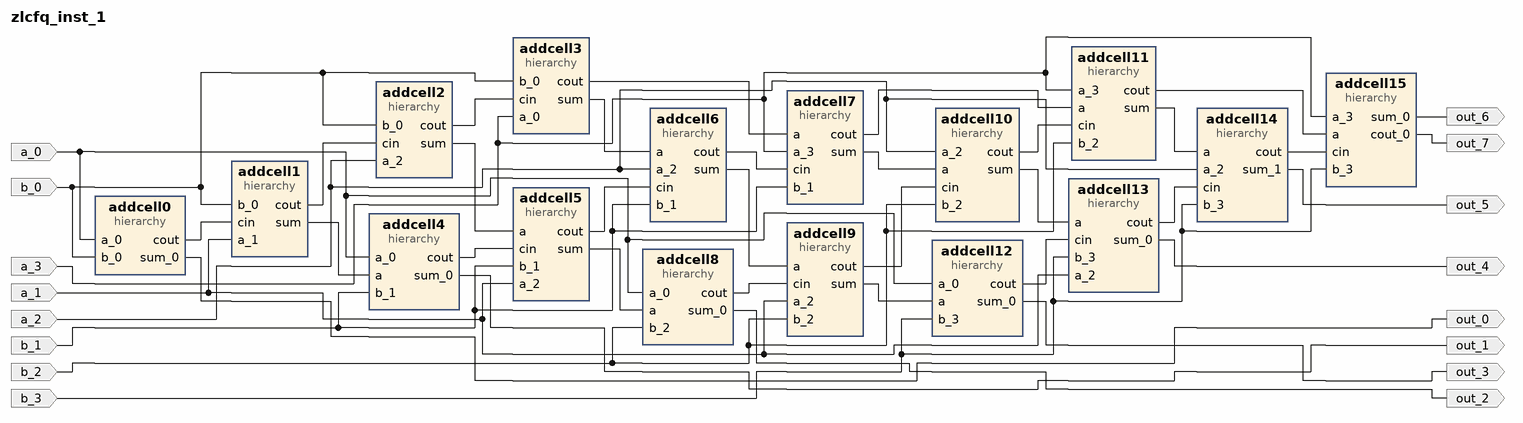
[diagram p0: block diagram of the top level]
# Vivado block design zlcfq_inst_1, xc7z020clg400-1, Vivado 2024.2
create_bd_design zlcfq_inst_1

create_bd_port -dir I a_0
create_bd_port -dir I a_1
create_bd_port -dir I a_2
create_bd_port -dir I a_3
create_bd_port -dir I b_0
create_bd_port -dir I b_1
create_bd_port -dir I b_2
create_bd_port -dir I b_3
create_bd_port -dir O out_0
create_bd_port -dir O out_1
create_bd_port -dir O out_2
create_bd_port -dir O out_3
create_bd_port -dir O out_4
create_bd_port -dir O out_5
create_bd_port -dir O out_6
create_bd_port -dir O out_7

create_bd_cell -type hier addcell0
create_bd_cell -type hier addcell1
create_bd_cell -type hier addcell10
create_bd_cell -type hier addcell11
create_bd_cell -type hier addcell12
create_bd_cell -type hier addcell13
create_bd_cell -type hier addcell14
create_bd_cell -type hier addcell15
create_bd_cell -type hier addcell2
create_bd_cell -type hier addcell3
create_bd_cell -type hier addcell4
create_bd_cell -type hier addcell5
create_bd_cell -type hier addcell6
create_bd_cell -type hier addcell7
create_bd_cell -type hier addcell8
create_bd_cell -type hier addcell9

# ---- hierarchy /addcell0 ----
current_bd_instance /addcell0
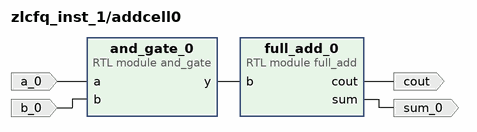
[diagram p1: block diagram inside /addcell0]
create_bd_pin -dir O cout
create_bd_pin -dir O sum_0
create_bd_pin -dir I a_0
create_bd_pin -dir I b_0

create_bd_cell -type module -reference full_add full_add_0
create_bd_cell -type module -reference and_gate and_gate_0

# ---- hierarchy /addcell1 ----
current_bd_instance /addcell1
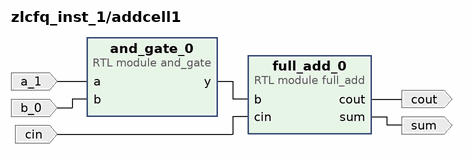
[diagram p2: block diagram inside /addcell1]
create_bd_pin -dir I cin
create_bd_pin -dir O cout
create_bd_pin -dir O sum
create_bd_pin -dir I a_1
create_bd_pin -dir I b_0

create_bd_cell -type module -reference full_add full_add_0
create_bd_cell -type module -reference and_gate and_gate_0

# ---- hierarchy /addcell10 ----
current_bd_instance /addcell10
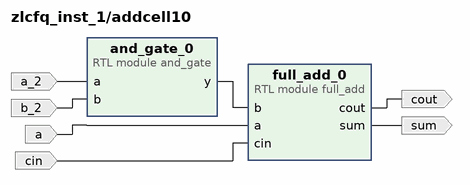
[diagram p3: block diagram inside /addcell10]
create_bd_pin -dir O cout
create_bd_pin -dir I cin
create_bd_pin -dir I a
create_bd_pin -dir O sum
create_bd_pin -dir I a_2
create_bd_pin -dir I b_2

create_bd_cell -type module -reference full_add full_add_0
create_bd_cell -type module -reference and_gate and_gate_0

# ---- hierarchy /addcell11 ----
current_bd_instance /addcell11
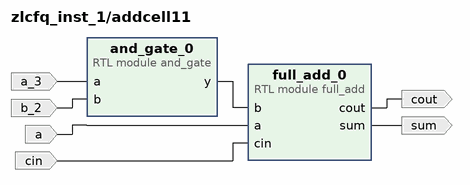
[diagram p4: block diagram inside /addcell11]
create_bd_pin -dir I cin
create_bd_pin -dir I a
create_bd_pin -dir O sum
create_bd_pin -dir O cout
create_bd_pin -dir I a_3
create_bd_pin -dir I b_2

create_bd_cell -type module -reference full_add full_add_0
create_bd_cell -type module -reference and_gate and_gate_0

# ---- hierarchy /addcell12 ----
current_bd_instance /addcell12
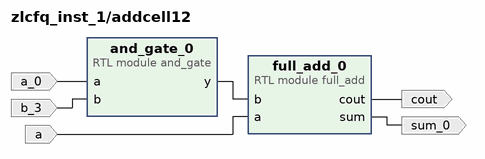
[diagram p5: block diagram inside /addcell12]
create_bd_pin -dir I a
create_bd_pin -dir O cout
create_bd_pin -dir O sum_0
create_bd_pin -dir I a_0
create_bd_pin -dir I b_3

create_bd_cell -type module -reference full_add full_add_0
create_bd_cell -type module -reference and_gate and_gate_0

# ---- hierarchy /addcell13 ----
current_bd_instance /addcell13
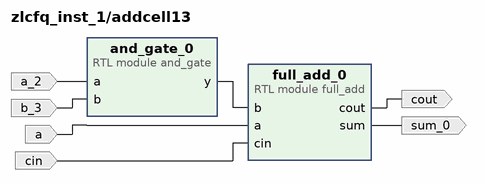
[diagram p6: block diagram inside /addcell13]
create_bd_pin -dir I cin
create_bd_pin -dir O cout
create_bd_pin -dir I a
create_bd_pin -dir O sum_0
create_bd_pin -dir I a_2
create_bd_pin -dir I b_3

create_bd_cell -type module -reference full_add full_add_0
create_bd_cell -type module -reference and_gate and_gate_0

# ---- hierarchy /addcell14 ----
current_bd_instance /addcell14
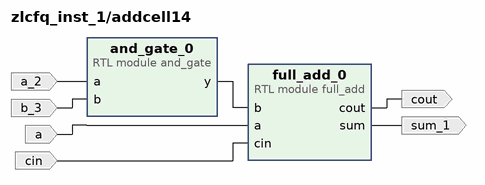
[diagram p7: block diagram inside /addcell14]
create_bd_pin -dir I cin
create_bd_pin -dir O cout
create_bd_pin -dir I a
create_bd_pin -dir O sum_1
create_bd_pin -dir I a_2
create_bd_pin -dir I b_3

create_bd_cell -type module -reference full_add full_add_0
create_bd_cell -type module -reference and_gate and_gate_0

# ---- hierarchy /addcell15 ----
current_bd_instance /addcell15
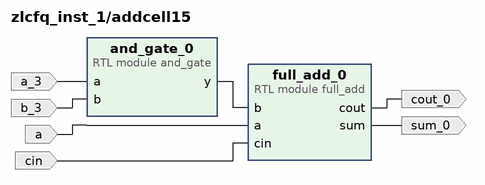
[diagram p8: block diagram inside /addcell15]
create_bd_pin -dir I cin
create_bd_pin -dir I a
create_bd_pin -dir O sum_0
create_bd_pin -dir O cout_0
create_bd_pin -dir I a_3
create_bd_pin -dir I b_3

create_bd_cell -type module -reference full_add full_add_0
create_bd_cell -type module -reference and_gate and_gate_0

# ---- hierarchy /addcell2 ----
current_bd_instance /addcell2
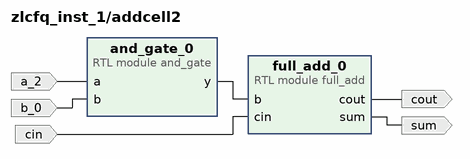
[diagram p9: block diagram inside /addcell2]
create_bd_pin -dir I cin
create_bd_pin -dir O cout
create_bd_pin -dir O sum
create_bd_pin -dir I a_2
create_bd_pin -dir I b_0

create_bd_cell -type module -reference full_add full_add_0
create_bd_cell -type module -reference and_gate and_gate_0

# ---- hierarchy /addcell3 ----
current_bd_instance /addcell3
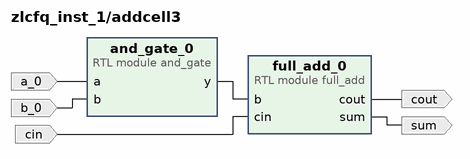
[diagram p10: block diagram inside /addcell3]
create_bd_pin -dir I cin
create_bd_pin -dir O sum
create_bd_pin -dir O cout
create_bd_pin -dir I a_0
create_bd_pin -dir I b_0

create_bd_cell -type module -reference full_add full_add_0
create_bd_cell -type module -reference and_gate and_gate_0

# ---- hierarchy /addcell4 ----
current_bd_instance /addcell4
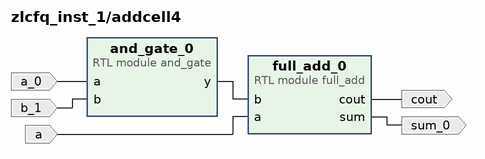
[diagram p11: block diagram inside /addcell4]
create_bd_pin -dir I a
create_bd_pin -dir O cout
create_bd_pin -dir O sum_0
create_bd_pin -dir I a_0
create_bd_pin -dir I b_1

create_bd_cell -type module -reference full_add full_add_0
create_bd_cell -type module -reference and_gate and_gate_0

# ---- hierarchy /addcell5 ----
current_bd_instance /addcell5
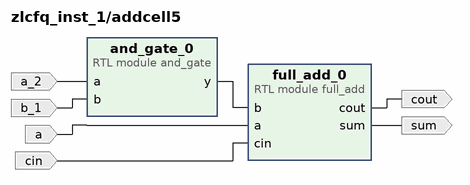
[diagram p12: block diagram inside /addcell5]
create_bd_pin -dir I cin
create_bd_pin -dir O cout
create_bd_pin -dir I a
create_bd_pin -dir O sum
create_bd_pin -dir I a_2
create_bd_pin -dir I b_1

create_bd_cell -type module -reference full_add full_add_0
create_bd_cell -type module -reference and_gate and_gate_0

# ---- hierarchy /addcell6 ----
current_bd_instance /addcell6
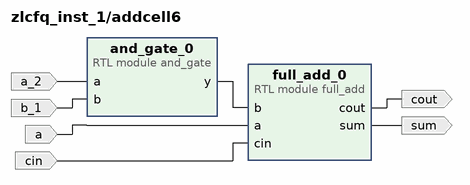
[diagram p13: block diagram inside /addcell6]
create_bd_pin -dir I cin
create_bd_pin -dir O cout
create_bd_pin -dir I a
create_bd_pin -dir O sum
create_bd_pin -dir I a_2
create_bd_pin -dir I b_1

create_bd_cell -type module -reference full_add full_add_0
create_bd_cell -type module -reference and_gate and_gate_0

# ---- hierarchy /addcell7 ----
current_bd_instance /addcell7
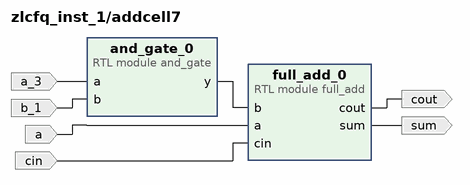
[diagram p14: block diagram inside /addcell7]
create_bd_pin -dir I cin
create_bd_pin -dir O sum
create_bd_pin -dir I a
create_bd_pin -dir O cout
create_bd_pin -dir I a_3
create_bd_pin -dir I b_1

create_bd_cell -type module -reference full_add full_add_0
create_bd_cell -type module -reference and_gate and_gate_0

# ---- hierarchy /addcell8 ----
current_bd_instance /addcell8
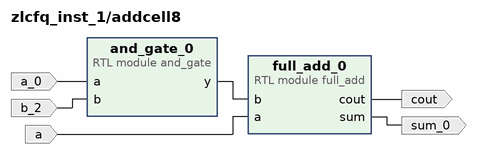
[diagram p15: block diagram inside /addcell8]
create_bd_pin -dir O cout
create_bd_pin -dir I a
create_bd_pin -dir O sum_0
create_bd_pin -dir I a_0
create_bd_pin -dir I b_2

create_bd_cell -type module -reference full_add full_add_0
create_bd_cell -type module -reference and_gate and_gate_0

# ---- hierarchy /addcell9 ----
current_bd_instance /addcell9
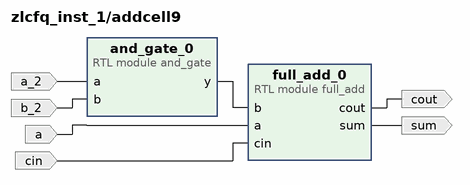
[diagram p16: block diagram inside /addcell9]
create_bd_pin -dir O cout
create_bd_pin -dir I cin
create_bd_pin -dir I a
create_bd_pin -dir O sum
create_bd_pin -dir I a_2
create_bd_pin -dir I b_2

create_bd_cell -type module -reference full_add full_add_0
create_bd_cell -type module -reference and_gate and_gate_0

# ---- connections ----

current_bd_instance /addcell0
connect_bd_net -net a_0_1 [get_bd_pins a_0] [get_bd_pins and_gate_0/a]
connect_bd_net [get_bd_pins and_gate_0/y] [get_bd_pins full_add_0/b]
connect_bd_net -net b_0_1 [get_bd_pins b_0] [get_bd_pins and_gate_0/b]
connect_bd_net [get_bd_pins full_add_0/cout] [get_bd_pins cout]
connect_bd_net [get_bd_pins full_add_0/sum] [get_bd_pins sum_0]

current_bd_instance /addcell1
connect_bd_net -net a_0_1 [get_bd_pins a_1] [get_bd_pins and_gate_0/a]
connect_bd_net [get_bd_pins and_gate_0/y] [get_bd_pins full_add_0/b]
connect_bd_net -net b_0_1 [get_bd_pins b_0] [get_bd_pins and_gate_0/b]
connect_bd_net [get_bd_pins cin] [get_bd_pins full_add_0/cin]
connect_bd_net [get_bd_pins full_add_0/cout] [get_bd_pins cout]
connect_bd_net [get_bd_pins full_add_0/sum] [get_bd_pins sum]

current_bd_instance /addcell10
connect_bd_net [get_bd_pins a] [get_bd_pins full_add_0/a]
connect_bd_net -net a_2_1 [get_bd_pins a_2] [get_bd_pins and_gate_0/a]
connect_bd_net [get_bd_pins and_gate_0/y] [get_bd_pins full_add_0/b]
connect_bd_net -net b_2_1 [get_bd_pins b_2] [get_bd_pins and_gate_0/b]
connect_bd_net [get_bd_pins cin] [get_bd_pins full_add_0/cin]
connect_bd_net [get_bd_pins full_add_0/cout] [get_bd_pins cout]
connect_bd_net [get_bd_pins full_add_0/sum] [get_bd_pins sum]

current_bd_instance /addcell11
connect_bd_net [get_bd_pins a] [get_bd_pins full_add_0/a]
connect_bd_net -net a_3_1 [get_bd_pins a_3] [get_bd_pins and_gate_0/a]
connect_bd_net [get_bd_pins and_gate_0/y] [get_bd_pins full_add_0/b]
connect_bd_net -net b_2_1 [get_bd_pins b_2] [get_bd_pins and_gate_0/b]
connect_bd_net [get_bd_pins cin] [get_bd_pins full_add_0/cin]
connect_bd_net [get_bd_pins full_add_0/cout] [get_bd_pins cout]
connect_bd_net [get_bd_pins full_add_0/sum] [get_bd_pins sum]

current_bd_instance /addcell12
connect_bd_net -net a_0_1 [get_bd_pins a_0] [get_bd_pins and_gate_0/a]
connect_bd_net [get_bd_pins a] [get_bd_pins full_add_0/a]
connect_bd_net [get_bd_pins and_gate_0/y] [get_bd_pins full_add_0/b]
connect_bd_net -net b_3_1 [get_bd_pins b_3] [get_bd_pins and_gate_0/b]
connect_bd_net [get_bd_pins full_add_0/cout] [get_bd_pins cout]
connect_bd_net [get_bd_pins full_add_0/sum] [get_bd_pins sum_0]

current_bd_instance /addcell13
connect_bd_net [get_bd_pins a] [get_bd_pins full_add_0/a]
connect_bd_net -net a_2_1 [get_bd_pins a_2] [get_bd_pins and_gate_0/a]
connect_bd_net [get_bd_pins and_gate_0/y] [get_bd_pins full_add_0/b]
connect_bd_net -net b_3_1 [get_bd_pins b_3] [get_bd_pins and_gate_0/b]
connect_bd_net [get_bd_pins cin] [get_bd_pins full_add_0/cin]
connect_bd_net [get_bd_pins full_add_0/cout] [get_bd_pins cout]
connect_bd_net [get_bd_pins full_add_0/sum] [get_bd_pins sum_0]

current_bd_instance /addcell14
connect_bd_net [get_bd_pins a] [get_bd_pins full_add_0/a]
connect_bd_net -net a_2_1 [get_bd_pins a_2] [get_bd_pins and_gate_0/a]
connect_bd_net [get_bd_pins and_gate_0/y] [get_bd_pins full_add_0/b]
connect_bd_net -net b_3_1 [get_bd_pins b_3] [get_bd_pins and_gate_0/b]
connect_bd_net [get_bd_pins cin] [get_bd_pins full_add_0/cin]
connect_bd_net [get_bd_pins full_add_0/cout] [get_bd_pins cout]
connect_bd_net [get_bd_pins full_add_0/sum] [get_bd_pins sum_1]

current_bd_instance /addcell15
connect_bd_net [get_bd_pins a] [get_bd_pins full_add_0/a]
connect_bd_net -net a_3_1 [get_bd_pins a_3] [get_bd_pins and_gate_0/a]
connect_bd_net [get_bd_pins and_gate_0/y] [get_bd_pins full_add_0/b]
connect_bd_net -net b_3_1 [get_bd_pins b_3] [get_bd_pins and_gate_0/b]
connect_bd_net [get_bd_pins cin] [get_bd_pins full_add_0/cin]
connect_bd_net [get_bd_pins full_add_0/cout] [get_bd_pins cout_0]
connect_bd_net [get_bd_pins full_add_0/sum] [get_bd_pins sum_0]

current_bd_instance /addcell2
connect_bd_net -net a_0_1 [get_bd_pins a_2] [get_bd_pins and_gate_0/a]
connect_bd_net [get_bd_pins and_gate_0/y] [get_bd_pins full_add_0/b]
connect_bd_net -net b_0_1 [get_bd_pins b_0] [get_bd_pins and_gate_0/b]
connect_bd_net [get_bd_pins cin] [get_bd_pins full_add_0/cin]
connect_bd_net [get_bd_pins full_add_0/cout] [get_bd_pins cout]
connect_bd_net [get_bd_pins full_add_0/sum] [get_bd_pins sum]

current_bd_instance /addcell3
connect_bd_net -net a_0_1 [get_bd_pins a_0] [get_bd_pins and_gate_0/a]
connect_bd_net [get_bd_pins and_gate_0/y] [get_bd_pins full_add_0/b]
connect_bd_net -net b_0_1 [get_bd_pins b_0] [get_bd_pins and_gate_0/b]
connect_bd_net [get_bd_pins cin] [get_bd_pins full_add_0/cin]
connect_bd_net [get_bd_pins full_add_0/cout] [get_bd_pins cout]
connect_bd_net [get_bd_pins full_add_0/sum] [get_bd_pins sum]

current_bd_instance /addcell4
connect_bd_net -net a_0_1 [get_bd_pins a_0] [get_bd_pins and_gate_0/a]
connect_bd_net [get_bd_pins a] [get_bd_pins full_add_0/a]
connect_bd_net [get_bd_pins and_gate_0/y] [get_bd_pins full_add_0/b]
connect_bd_net -net b_1_1 [get_bd_pins b_1] [get_bd_pins and_gate_0/b]
connect_bd_net [get_bd_pins full_add_0/cout] [get_bd_pins cout]
connect_bd_net [get_bd_pins full_add_0/sum] [get_bd_pins sum_0]

current_bd_instance /addcell5
connect_bd_net [get_bd_pins a] [get_bd_pins full_add_0/a]
connect_bd_net -net a_2_1 [get_bd_pins a_2] [get_bd_pins and_gate_0/a]
connect_bd_net [get_bd_pins and_gate_0/y] [get_bd_pins full_add_0/b]
connect_bd_net -net b_1_1 [get_bd_pins b_1] [get_bd_pins and_gate_0/b]
connect_bd_net [get_bd_pins cin] [get_bd_pins full_add_0/cin]
connect_bd_net [get_bd_pins full_add_0/cout] [get_bd_pins cout]
connect_bd_net [get_bd_pins full_add_0/sum] [get_bd_pins sum]

current_bd_instance /addcell6
connect_bd_net [get_bd_pins a] [get_bd_pins full_add_0/a]
connect_bd_net -net a_2_1 [get_bd_pins a_2] [get_bd_pins and_gate_0/a]
connect_bd_net [get_bd_pins and_gate_0/y] [get_bd_pins full_add_0/b]
connect_bd_net -net b_1_1 [get_bd_pins b_1] [get_bd_pins and_gate_0/b]
connect_bd_net [get_bd_pins cin] [get_bd_pins full_add_0/cin]
connect_bd_net [get_bd_pins full_add_0/cout] [get_bd_pins cout]
connect_bd_net [get_bd_pins full_add_0/sum] [get_bd_pins sum]

current_bd_instance /addcell7
connect_bd_net [get_bd_pins a] [get_bd_pins full_add_0/a]
connect_bd_net -net a_3_1 [get_bd_pins a_3] [get_bd_pins and_gate_0/a]
connect_bd_net [get_bd_pins and_gate_0/y] [get_bd_pins full_add_0/b]
connect_bd_net -net b_1_1 [get_bd_pins b_1] [get_bd_pins and_gate_0/b]
connect_bd_net [get_bd_pins cin] [get_bd_pins full_add_0/cin]
connect_bd_net [get_bd_pins full_add_0/cout] [get_bd_pins cout]
connect_bd_net [get_bd_pins full_add_0/sum] [get_bd_pins sum]

current_bd_instance /addcell8
connect_bd_net -net a_0_1 [get_bd_pins a_0] [get_bd_pins and_gate_0/a]
connect_bd_net [get_bd_pins a] [get_bd_pins full_add_0/a]
connect_bd_net [get_bd_pins and_gate_0/y] [get_bd_pins full_add_0/b]
connect_bd_net -net b_2_1 [get_bd_pins b_2] [get_bd_pins and_gate_0/b]
connect_bd_net [get_bd_pins full_add_0/cout] [get_bd_pins cout]
connect_bd_net [get_bd_pins full_add_0/sum] [get_bd_pins sum_0]

current_bd_instance /addcell9
connect_bd_net [get_bd_pins a] [get_bd_pins full_add_0/a]
connect_bd_net -net a_2_1 [get_bd_pins a_2] [get_bd_pins and_gate_0/a]
connect_bd_net [get_bd_pins and_gate_0/y] [get_bd_pins full_add_0/b]
connect_bd_net -net b_2_1 [get_bd_pins b_2] [get_bd_pins and_gate_0/b]
connect_bd_net [get_bd_pins cin] [get_bd_pins full_add_0/cin]
connect_bd_net [get_bd_pins full_add_0/cout] [get_bd_pins cout]
connect_bd_net [get_bd_pins full_add_0/sum] [get_bd_pins sum]

current_bd_instance /
connect_bd_net -net a_0_0_1 [get_bd_ports a_0] \
  [get_bd_pins addcell0/a_0] [get_bd_pins addcell8/a_0] [get_bd_pins addcell12/a_0] [get_bd_pins addcell4/a_0]
connect_bd_net -net a_0_1_1 [get_bd_ports a_3] \
  [get_bd_pins addcell7/a_3] [get_bd_pins addcell11/a_3] [get_bd_pins addcell15/a_3] [get_bd_pins addcell3/a_0]
connect_bd_net -net a_1_0_1 [get_bd_ports a_1] \
  [get_bd_pins addcell1/a_1] [get_bd_pins addcell5/a_2] [get_bd_pins addcell9/a_2] [get_bd_pins addcell13/a_2]
connect_bd_net -net a_2_0_1 [get_bd_ports a_2] \
  [get_bd_pins addcell6/a_2] [get_bd_pins addcell10/a_2] [get_bd_pins addcell14/a_2] [get_bd_pins addcell2/a_2]
connect_bd_net [get_bd_pins addcell0/cout] [get_bd_pins addcell1/cin]
connect_bd_net [get_bd_pins addcell0/sum_0] [get_bd_ports out_0]
connect_bd_net [get_bd_pins addcell10/sum] [get_bd_pins addcell13/a]
connect_bd_net [get_bd_pins addcell11/cout] [get_bd_pins addcell15/a]
connect_bd_net [get_bd_pins addcell11/sum] [get_bd_pins addcell14/a]
connect_bd_net [get_bd_pins addcell12/cout] [get_bd_pins addcell13/cin]
connect_bd_net [get_bd_pins addcell12/sum_0] [get_bd_ports out_3]
connect_bd_net [get_bd_pins addcell13/cout] [get_bd_pins addcell14/cin]
connect_bd_net [get_bd_pins addcell13/sum_0] [get_bd_ports out_4]
connect_bd_net [get_bd_pins addcell14/cout] [get_bd_pins addcell15/cin]
connect_bd_net [get_bd_pins addcell14/sum_1] [get_bd_ports out_5]
connect_bd_net [get_bd_pins addcell15/cout_0] [get_bd_ports out_7]
connect_bd_net [get_bd_pins addcell15/sum_0] [get_bd_ports out_6]
connect_bd_net [get_bd_pins addcell1/cout] [get_bd_pins addcell2/cin]
connect_bd_net [get_bd_pins addcell1/sum] [get_bd_pins addcell4/a]
connect_bd_net [get_bd_pins addcell2/cout] [get_bd_pins addcell3/cin]
connect_bd_net [get_bd_pins addcell2/sum] [get_bd_pins addcell5/a]
connect_bd_net [get_bd_pins addcell3/cout] [get_bd_pins addcell7/a]
connect_bd_net [get_bd_pins addcell3/sum] [get_bd_pins addcell6/a]
connect_bd_net [get_bd_pins addcell4/cout] [get_bd_pins addcell5/cin]
connect_bd_net [get_bd_pins addcell4/sum_0] [get_bd_ports out_1]
connect_bd_net [get_bd_pins addcell5/cout] [get_bd_pins addcell6/cin]
connect_bd_net [get_bd_pins addcell5/sum] [get_bd_pins addcell8/a]
connect_bd_net [get_bd_pins addcell6/cout] [get_bd_pins addcell7/cin]
connect_bd_net [get_bd_pins addcell6/sum] [get_bd_pins addcell9/a]
connect_bd_net [get_bd_pins addcell7/cout] [get_bd_pins addcell11/a]
connect_bd_net [get_bd_pins addcell7/sum] [get_bd_pins addcell10/a]
connect_bd_net [get_bd_pins addcell8/cout] [get_bd_pins addcell9/cin]
connect_bd_net [get_bd_pins addcell8/sum_0] [get_bd_ports out_2]
connect_bd_net [get_bd_pins addcell9/cout] [get_bd_pins addcell10/cin]
connect_bd_net [get_bd_pins addcell9/sum] [get_bd_pins addcell12/a]
connect_bd_net -net b_0_1 [get_bd_ports b_0] \
  [get_bd_pins addcell2/b_0] [get_bd_pins addcell3/b_0] [get_bd_pins addcell0/b_0] [get_bd_pins addcell1/b_0]
connect_bd_net -net b_1_1 [get_bd_ports b_1] \
  [get_bd_pins addcell5/b_1] [get_bd_pins addcell6/b_1] [get_bd_pins addcell7/b_1] [get_bd_pins addcell4/b_1]
connect_bd_net -net b_2_1 [get_bd_ports b_2] \
  [get_bd_pins addcell9/b_2] [get_bd_pins addcell10/b_2] [get_bd_pins addcell11/b_2] [get_bd_pins addcell8/b_2]
connect_bd_net -net b_3_1 [get_bd_ports b_3] \
  [get_bd_pins addcell12/b_3] [get_bd_pins addcell14/b_3] [get_bd_pins addcell15/b_3] [get_bd_pins addcell13/b_3]
connect_bd_net -net cin_1 [get_bd_pins addcell10/cout] [get_bd_pins addcell11/cin]

validate_bd_design
save_bd_design
